# Altium schematic sheet Top Level.SchDoc: 2R Robot Top Level Electrical Design
size A; Author: C. Miller; CompanyName: Northwestern University; DrawnBy: C. Miller; Engineer: C. Miller; Organization: Northwestern Univrsity; Address1: C. Miller 2018; Address2: ME495: RDS; Address3: chris.x.miller; Address4: @u.northwestern.edu; Revision: 1; SheetNumber: 1; SheetTotal: 6; ImagePath: C:\Users\chris\Box Sync\001_Year 1\005_ME_495_DesignStudio\007_ElectronicDesign\logo.png
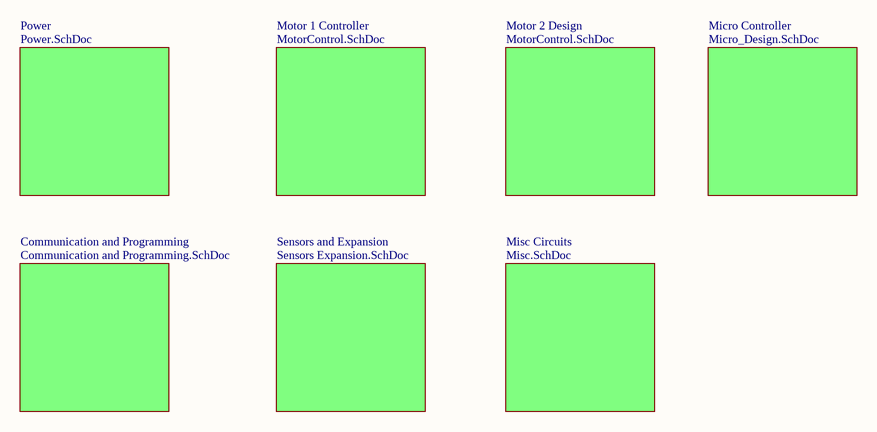
[diagram p0: Top Level.SchDoc]

## Sub-sheets
Communication and Programming = Communication and Programming.SchDoc: no entries
Micro Controller = Micro_Design.SchDoc: no entries
Misc Circuits = Misc.SchDoc: no entries
Motor 1 Controller = MotorControl.SchDoc: no entries
Motor 2 Design = MotorControl.SchDoc: no entries
Power = Power.SchDoc: no entries
Sensors and Expansion = Sensors Expansion.SchDoc: no entries

## Notes on the sheet
- Title
- Size:
- Date:
- A
- Number:
- Time:
- Revision:
- Sheet
- of
- File: